# Altium schematic sheet SDRAM.SchDoc: SDRAM (MICRON)
size A4; Date: 29-OCT-2015; Author: A.B; CompanyName: STMicroelectronics; Organization: MCD/TOOLS/GNB; Address1: 12, Rue Jules HOROWITZ; Address2: 38019 Grenoble; Address3: FRANCE; DocumentNumber: MB1225; Revision: B-01; SheetNumber: 6; SheetTotal: 13; Project: STM32F769I-DISCO
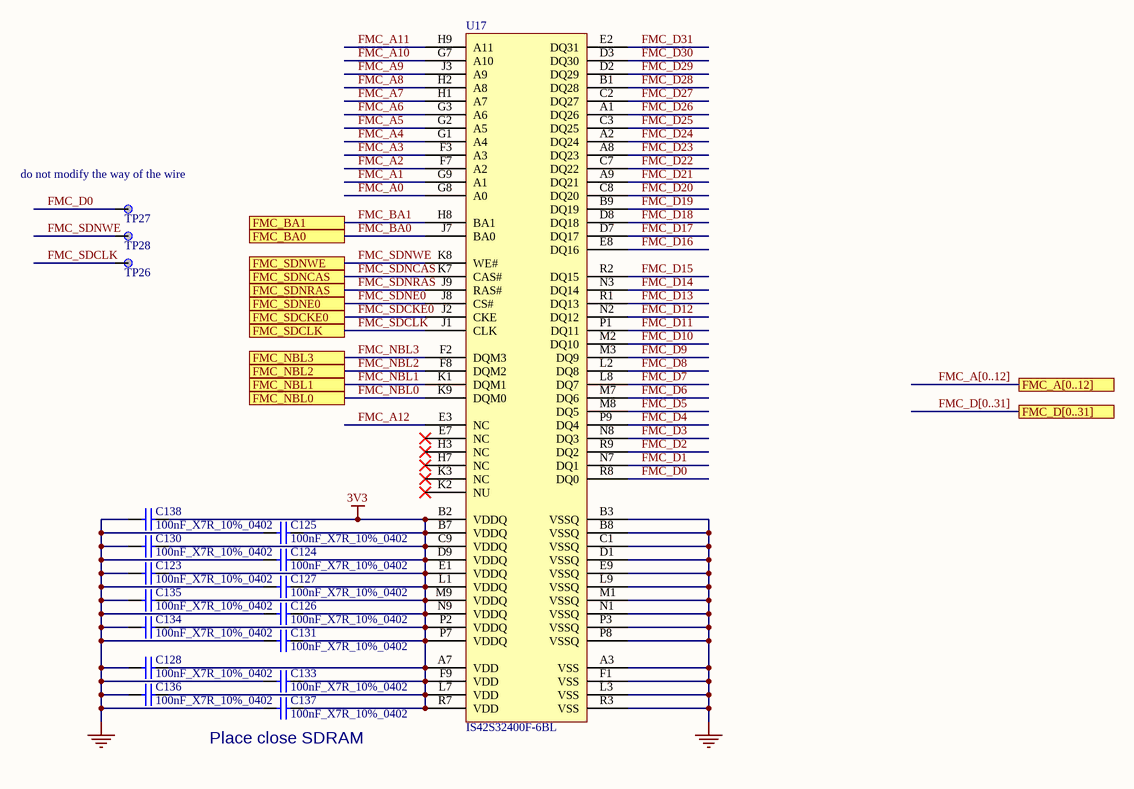
[diagram p0: SDRAM.SchDoc]

## Parts
C123  100nF_X7R_10%_0402  [0402C]
C124  100nF_X7R_10%_0402  [0402C]
C125  100nF_X7R_10%_0402  [0402C]
C126  100nF_X7R_10%_0402  [0402C]
C127  100nF_X7R_10%_0402  [0402C]
C128  100nF_X7R_10%_0402  [0402C]
C130  100nF_X7R_10%_0402  [0402C]
C131  100nF_X7R_10%_0402  [0402C]
C133  100nF_X7R_10%_0402  [0402C]
C134  100nF_X7R_10%_0402  [0402C]
C135  100nF_X7R_10%_0402  [0402C]
C136  100nF_X7R_10%_0402  [0402C]
C137  100nF_X7R_10%_0402  [0402C]
C138  100nF_X7R_10%_0402  [0402C]
TP26  TP  [TP_C40]  (value not drawn)
TP27  TP  [TP_C40]  (value not drawn)
TP28  TP  [TP_C40]  (value not drawn)
U17  IS42S32400F-6BL  [ICC_VFBGA90_8X13_P080]

## Ports
FMC_A[0..12], FMC_BA0, FMC_BA1, FMC_D[0..31], FMC_NBL0, FMC_NBL1, FMC_NBL2, FMC_NBL3, FMC_SDCKE0, FMC_SDCLK, FMC_SDNCAS, FMC_SDNE0, FMC_SDNRAS, FMC_SDNWE

## Nets
3V3: C123.2 C124.2 C125.2 C126.2 C127.2 C128.2 C130.2 C131.2 C133.2 C134.2 C135.2 C136.2 C137.2 C138.2 U17.A7(VDD) U17.B2(VDDQ) U17.B7(VDDQ) U17.C9(VDDQ) U17.D9(VDDQ) U17.E1(VDDQ) U17.F9(VDD) U17.L1(VDDQ) U17.L7(VDD) U17.M9(VDDQ) U17.N9(VDDQ) U17.P2(VDDQ) U17.P7(VDDQ) U17.R7(VDD)
GND: C123.1 C124.1 C125.1 C126.1 C127.1 C128.1 C130.1 C131.1 C133.1 C134.1 C135.1 C136.1 C137.1 C138.1 U17.A3(VSS) U17.B3(VSSQ) U17.B8(VSSQ) U17.C1(VSSQ) U17.D1(VSSQ) U17.E9(VSSQ) U17.F1(VSS) U17.L3(VSS) U17.L9(VSSQ) U17.M1(VSSQ) U17.N1(VSSQ) U17.P3(VSSQ) U17.P8(VSSQ) U17.R3(VSS)
FMC_A0: U17.G8(A0)
FMC_A1: U17.G9(A1)
FMC_A2: U17.F7(A2)
FMC_A3: U17.F3(A3)
FMC_A4: U17.G1(A4)
FMC_A5: U17.G2(A5)
FMC_A6: U17.G3(A6)
FMC_A7: U17.H1(A7)
FMC_A8: U17.H2(A8)
FMC_A9: U17.J3(A9)
FMC_A10: U17.G7(A10)
FMC_A11: U17.H9(A11)
FMC_A12: U17.E3(NC)
FMC_BA0: U17.J7(BA0) ; port FMC_BA0
FMC_BA1: U17.H8(BA1) ; port FMC_BA1
FMC_D0: TP27.1 U17.R8(DQ0)
FMC_D1: U17.N7(DQ1)
FMC_D2: U17.R9(DQ2)
FMC_D3: U17.N8(DQ3)
FMC_D4: U17.P9(DQ4)
FMC_D5: U17.M8(DQ5)
FMC_D6: U17.M7(DQ6)
FMC_D7: U17.L8(DQ7)
FMC_D8: U17.L2(DQ8)
FMC_D9: U17.M3(DQ9)
FMC_D10: U17.M2(DQ10)
FMC_D11: U17.P1(DQ11)
FMC_D12: U17.N2(DQ12)
FMC_D13: U17.R1(DQ13)
FMC_D14: U17.N3(DQ14)
FMC_D15: U17.R2(DQ15)
FMC_D16: U17.E8(DQ16)
FMC_D17: U17.D7(DQ17)
FMC_D18: U17.D8(DQ18)
FMC_D19: U17.B9(DQ19)
FMC_D20: U17.C8(DQ20)
FMC_D21: U17.A9(DQ21)
FMC_D22: U17.C7(DQ22)
FMC_D23: U17.A8(DQ23)
FMC_D24: U17.A2(DQ24)
FMC_D25: U17.C3(DQ25)
FMC_D26: U17.A1(DQ26)
FMC_D27: U17.C2(DQ27)
FMC_D28: U17.B1(DQ28)
FMC_D29: U17.D2(DQ29)
FMC_D30: U17.D3(DQ30)
FMC_D31: U17.E2(DQ31)
FMC_NBL0: U17.K9(DQM0) ; port FMC_NBL0
FMC_NBL1: U17.K1(DQM1) ; port FMC_NBL1
FMC_NBL2: U17.F8(DQM2) ; port FMC_NBL2
FMC_NBL3: U17.F2(DQM3) ; port FMC_NBL3
FMC_SDCKE0: U17.J2(CKE) ; port FMC_SDCKE0
FMC_SDCLK: TP26.1 U17.J1(CLK) ; port FMC_SDCLK
FMC_SDNCAS: U17.K7(CAS#) ; port FMC_SDNCAS
FMC_SDNE0: U17.J8(CS#) ; port FMC_SDNE0
FMC_SDNRAS: U17.J9(RAS#) ; port FMC_SDNRAS
FMC_SDNWE: TP28.1 U17.K8(WE#) ; port FMC_SDNWE

Not connected (* = marked no-connect by the designer): U17 E7(NC)* H3(NC)* H7(NC)* K2(NU)* K3(NC)*

## Buses and harness runs
bus FMC_A[0..12] = port FMC_A[0..12]
bus FMC_D[0..31] = port FMC_D[0..31]

## Notes on the sheet
- (near TP27) do not modify the way of the wire
- (near C137) Place close SDRAM
- Title:
- Project:
- Size:
- Revision:
- Variant:
- A4
- -
- Date:
- Reference:
- Sheet:
- of

## Library data of the parts
C123-C128 C130 C131 C133-C138 = Cap_100nF_X7R_10%_0402: Capacitor,100nF,16V,X7R,10%,0402,YAGEO; Manuf_Part_1: CC0402KRX7R7BB104; Revision: July-2002: Re-released for DXP Platform.; Value: 100nF; Order: CC0402KRX7R7BB104; Manuf_1: YAGEO; ECCN_US/EU: n/a
TP26-TP28 = TP: Test Point; ECCN_US/EU: n/a
U17 = MCD-01977: SDRAM 128MBit 166MHZ 90BGA; Part_Type: IC; Part_Preference: Recommended; Manufacturer: ISSI; Component_Country_Of_Origin: China, Taiwan; Internal_Part_Number: MCD-01977; Value: IS42S32400F-6BL; Status: Released; Manufacturer_Part_Number: IS42S32400F-6BL; ComponentLink1URL: http://tunmcdsvn.tun.st.com/Component_Datasheet_Library/Trunk/IC/ISSI_IS42S32400F-6BL; Order_Code_Digikey: IS42S32400F-6BL-ND; Order_Code_Farnell: N/A; Order_Code_RS: N/A